# EasyEDA schematic SCH_Plantcare_Module-v3_2024-10-24.json
TITLE: Sheet_1; REV: 1.0; Date: 2024-10-19; Sheet: 1/1; Drawn By: arek.stasko; Company: Your Company
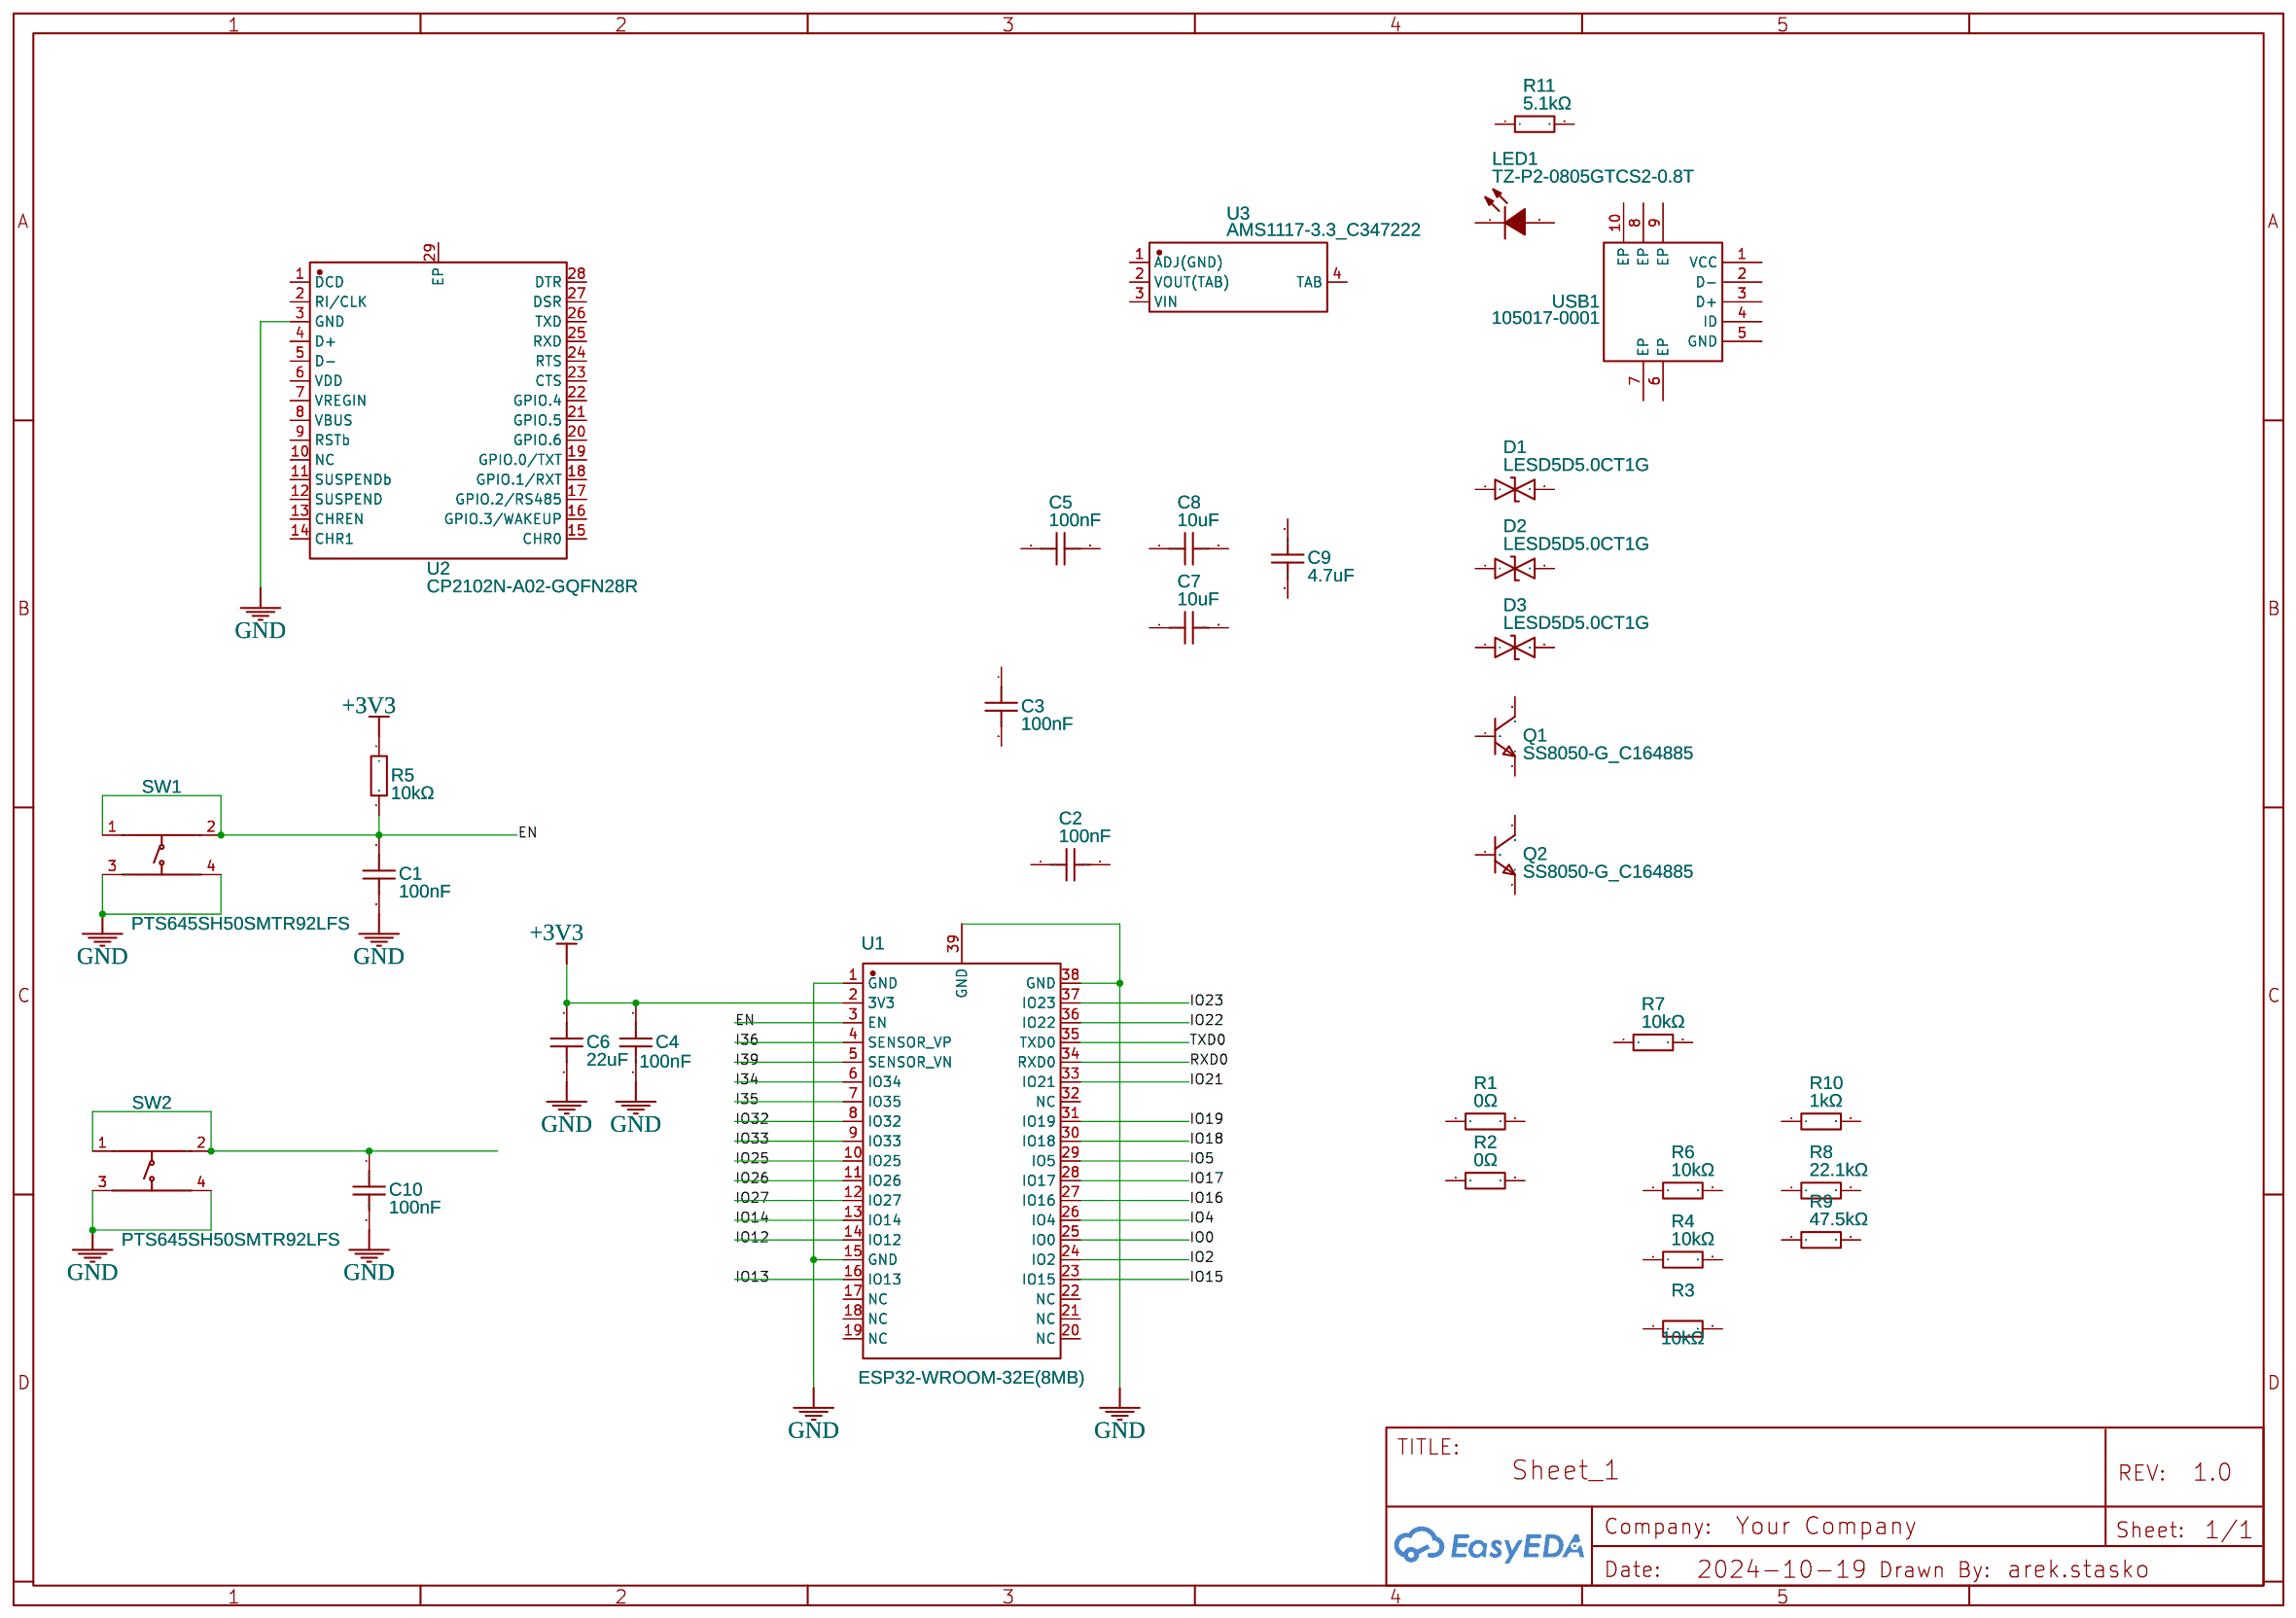
[diagram p0: schematic sheet]

## Parts
C1  100nF  [C0402]
C2  100nF  [C0402]
C3  100nF  [C0402]
C4  100nF  [C0402]
C5  100nF  [C0402]
C6  22uF  [C0805]
C7  10uF  [C0402]
C8  10uF  [C0402]
C9  4.7uF  [C0402]
C10  100nF  [C0402]
D1  LESD5D5.0CT1G  [SOD-523_L1.2-W0.8-LS1.6-BI]
D2  LESD5D5.0CT1G  [SOD-523_L1.2-W0.8-LS1.6-BI]
D3  LESD5D5.0CT1G  [SOD-523_L1.2-W0.8-LS1.6-BI]
LED1  TZ-P2-0805GTCS2-0.8T  [LED0805-RD_GREEN]
Q1  SS8050-G_C164885  [SOT-23-3_L2.9-W1.3-P1.90-LS2.4-BR]
Q2  SS8050-G_C164885  [SOT-23-3_L2.9-W1.3-P1.90-LS2.4-BR]
R1  0Ω  [R0402]
R2  0Ω  [R0402]
R3  10kΩ  [R0402]
R4  10kΩ  [R0402]
R5  10kΩ  [R0402]
R6  10kΩ  [R0402]
R7  10kΩ  [R0402]
R8  22.1kΩ  [R0402]
R9  47.5kΩ  [R0402]
R10  1kΩ  [R0402]
R11  5.1kΩ  [R0402]
SW1  PTS645SH50SMTR92LFS  [KEY-SMD_4P-L6.0-W6.0-P4.50-LS9.0]
SW2  PTS645SH50SMTR92LFS  [KEY-SMD_4P-L6.0-W6.0-P4.50-LS9.0]
U1  ESP32-WROOM-32E(8MB)  [WIFI-SMD_ESP32-WROOM-32E]
U2  CP2102N-A02-GQFN28R  [QFN-28_L5.0-W5.0-P0.50-TL-EP3.3]
U3  AMS1117-3.3_C347222  [SOT-223-4_L6.5-W3.5-P2.30-LS7.0-BR]
USB1  105017-0001  [MICRO-USB-SMD_105017-0001]

## Library data of the parts
C1-C5 C10 = CL05B104KO5NNNC: Supplier: LCSC; Manufacturer: SAMSUNG(三星); Supplier Part: C1525; JLCPCB Part Class: Basic Part
C6 = CL21A226MAYNNNE: Contributor: LCSC; Supplier: LCSC; Supplier Part: C602037; Manufacturer: SAMSUNG(三星); JLCPCB Part Class: Extended Part
C7 C8 = CL05A106MP5NUNC_C315248: Contributor: LCSC; Supplier: LCSC; Supplier Part: C315248; Manufacturer: SAMSUNG(三星); Manufacturer Part: CL05A106MP5NUNC; JLCPCB Part Class: Extended Part
C9 = CL05A475KP5NRNC: Contributor: LCSC; Supplier: LCSC; Supplier Part: C368809; Manufacturer: SAMSUNG(三星); JLCPCB Part Class: Extended Part
D1-D3 = LESD5D5.0CT1G: Contributor: LCSC; Supplier: LCSC; Supplier Part: C383211; Manufacturer: LRC(乐山无线电); JLCPCB Part Class: Extended Part
LED1 = TZ-P2-0805GTCS2-0.8T: Contributor: LCSC; Supplier: LCSC; Supplier Part: C688883; Manufacturer: TUOZHAN(拓展光电); JLCPCB Part Class: Extended Part
Q1 Q2 = SS8050-G_C164885: Contributor: LCSC; Supplier: LCSC; Supplier Part: C164885; Manufacturer: CJ(江苏长电/长晶); Manufacturer Part: SS8050-G; JLCPCB Part Class: Extended Part
R1 R2 = 0402WGF0000TCE: Supplier: LCSC; Manufacturer: UNI-ROYAL(厚声); Supplier Part: C17168; JLCPCB Part Class: Basic Part
R3-R7 = 0402WGF1002TCE: Supplier: LCSC; Manufacturer: UNI-ROYAL(厚声); Supplier Part: C25744; JLCPCB Part Class: Basic Part
R8 = 0402WGF2212TCE: Supplier: LCSC; Manufacturer: UNI-ROYAL(厚声); Supplier Part: C43473; JLCPCB Part Class: Extended Part
R9 = 0402WGF4752TCE: Supplier: LCSC; Manufacturer: UNI-ROYAL(厚声); Supplier Part: C25896; JLCPCB Part Class: Extended Part
R10 = 0402WGF1001TCE: Supplier: LCSC; Manufacturer: UNI-ROYAL(厚声); Supplier Part: C11702; JLCPCB Part Class: Basic Part
R11 = 0402WGF5101TCE: Supplier: LCSC; Manufacturer: UNI-ROYAL(厚声); Supplier Part: C25905; JLCPCB Part Class: Basic Part
SW1 SW2 = PTS645SH50SMTR92LFS: Contributor: LCSC; Supplier: LCSC; Supplier Part: C221869; Manufacturer: C&K; JLCPCB Part Class: Extended Part
U1 = ESP32-WROOM-32E(8MB): Contributor: LCSC; Supplier: LCSC; Supplier Part: C701342; Manufacturer: ESPRESSIF(乐鑫); Manufacturer Part: ESP32-WROOM-32E-N8; JLCPCB Part Class: Extended Part
U2 = CP2102N-A02-GQFN28R: Contributor: LCSC; Supplier: LCSC; Supplier Part: C964632; Manufacturer: SKYWORKS/SILICON LABS(芯科); JLCPCB Part Class: Extended Part
U3 = AMS1117-3.3_C347222: Contributor: LCSC; Supplier: LCSC; Supplier Part: C347222; Manufacturer: UMW(友台半导体); Manufacturer Part: AMS1117-3.3; JLCPCB Part Class: Extended Part
USB1 = 105017-0001: Contributor: LCSC; Supplier: LCSC; Manufacturer: MOLEX; Manufacturer Part: 1050170001; Supplier Part: C136000; JLCPCB Part Class: Extended Part

## Nets
+3V3: C4.1 C6.1 R5.1 U1.2(3V3)
GND: C1.2 C4.2 C6.2 C10.2 SW1.3 SW1.4 SW2.3 SW2.4 U1.1(GND) U1.15(GND) U1.38(GND) U1.39(GND) U2.3(GND)
EN: C1.1 R5.2 SW1.1 SW1.2 U1.3(EN)
I34: U1.6(IO34)
I35: U1.7(IO35)
I36: U1.4(SENSOR_VP)
I39: U1.5(SENSOR_VN)
IO0: U1.25(IO0)
IO2: U1.24(IO2)
IO4: U1.26(IO4)
IO5: U1.29(IO5)
IO12: U1.14(IO12)
IO13: U1.16(IO13)
IO14: U1.13(IO14)
IO15: U1.23(IO15)
IO16: U1.27(IO16)
IO17: U1.28(IO17)
IO18: U1.30(IO18)
IO19: U1.31(IO19)
IO21: U1.33(IO21)
IO22: U1.36(IO22)
IO23: U1.37(IO23)
IO25: U1.10(IO25)
IO26: U1.11(IO26)
IO27: U1.12(IO27)
IO32: U1.8(IO32)
IO33: U1.9(IO33)
RXD0: U1.34(RXD0)
TXD0: U1.35(TXD0)
Net-(C10-1): C10.1 SW2.1 SW2.2

Not connected (* = marked no-connect by the designer): C2 1 2; C3 1 2; C5 1 2; C7 1 2; C8 1 2; C9 1 2; D1 1 2; D2 1 2; D3 1 2; LED1 1(-) 2(+); Q1 1(B) 2(E) 3(C); Q2 1(B) 2(E) 3(C); R1 1 2; R2 1 2; R3 1 2; R4 1 2; R6 1 2; R7 1 2; R8 1 2; R9 1 2; R10 1 2; R11 1 2; U1 17(NC) 18(NC) 19(NC) 20(NC) 21(NC) 22(NC) 32(NC); U2 1(DCD) 2(RI/CLK) 4(D+) 5(D-) 6(VDD) 7(VREGIN) 8(VBUS) 9(RSTb) 10(NC) 11(SUSPENDb) 12(SUSPEND) 13(CHREN) 14(CHR1) 15(CHR0) 16(GPIO.3/WAKEUP) 17(GPIO.2/RS485) 18(GPIO.1/RXT) 19(GPIO.0/TXT) 20(GPIO.6) 21(GPIO.5) 22(GPIO.4) 23(CTS) 24(RTS) 25(RXD) 26(TXD) 27(DSR) 28(DTR) 29(EP); U3 1(ADJ(GND)) 2(VOUT(TAB)) 3(VIN) 4(TAB); USB1 1(VCC) 2(D-) 3(D+) 4(ID) 5(GND) 6(EP) 7(EP) 8(EP) 9(EP) 10(EP)
